# Altium schematic sheet INV.Main.SCH.SchDoc (part 2 of 2)
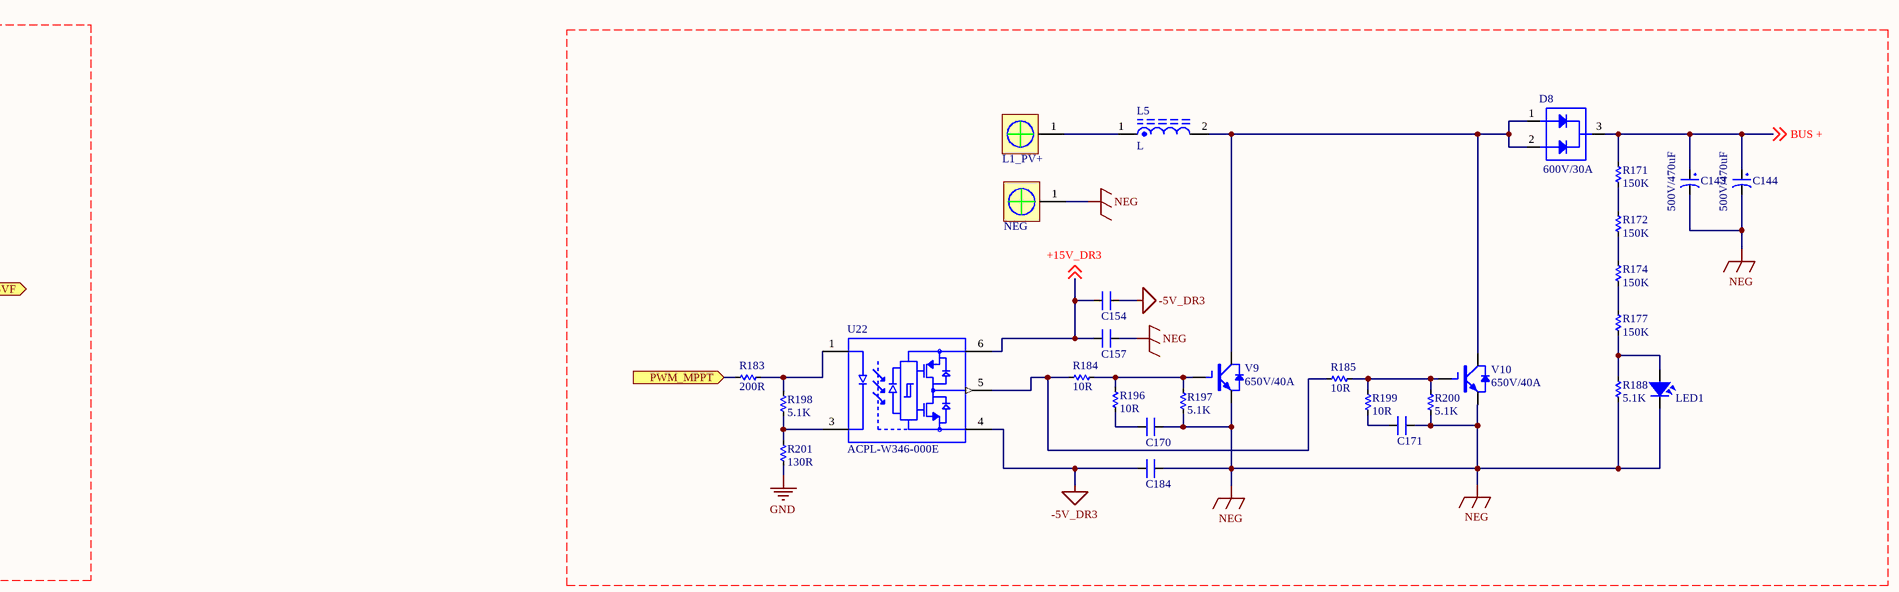
[diagram p8: INV.Main.SCH.SchDoc, bottom column 4 of 4]

## Library data of the parts
1 R167 R168 R173 R189 R205 R213 = Res-SMD: 1210; Manufacturer: Generic Components; Class: Passive; Published: 08/06/2000; Publisher: Altium Hobart Technology Centre
*1-*4 AC_L1 AC_N1 BAT+1 BAT-1 BUS_+1 L4 NEG1 = Copper
BT1 T3 = Tranfomer EE13: Designed by: VanDungEvn; Value: BAX
C1-C6 C9-C14 C17-C33 C35-C52 C54-C64 C70-C109 C112 C113 C131 C134 C139-C141 C154-C157 C164 C165 C170 C171 C184 = CAP-SMD: Value: 33pF
C7 = CAP C3D 35x46x35mm: capacitor E256238; MP: ECWFG2J475KA; MF: Panasonic; Value: *; Price: None; Package: MOLDED-2 Panasonic; Availability: In Stock; Check_prices: https://www.snapeda.com/parts/ECWFG2J475KA/Panasonic/view-part/?ref=eda; SnapEDA_Link: https://www.snapeda.com/parts/ECWFG2J475KA/Panasonic/view-part/?ref=snap
C8 C115 = Cap an toan: Metallized Polypropylene Film Capacitor; MP: ECWFG2J475KA; MF: Panasonic; Value: *; Price: None; Package: MOLDED-2 Panasonic; Availability: In Stock; Check_prices: https://www.snapeda.com/parts/ECWFG2J475KA/Panasonic/view-part/?ref=eda; SnapEDA_Link: https://www.snapeda.com/parts/ECWFG2J475KA/Panasonic/view-part/?ref=snap
C15 C16 C132 C133 C138 C142-C144 = Cap - 10x18 - N: Cắm; Don_Vi: Con; So_Chan: 2; Ten_Linh_Kien: Tụ Hóa 220uF 10V 6x11MM; Ma_Hang: MH004510; Chung_Loai: Cắm; Kieu_Chan: *
C34 C114 C203 = CAP N5-1n/500V: Metallized Polypropylene Film Capacitor; MP: ECWFG2J475KA; MF: Panasonic; Value: *; Price: None; Package: MOLDED-2 Panasonic; Availability: In Stock; Check_prices: https://www.snapeda.com/parts/ECWFG2J475KA/Panasonic/view-part/?ref=eda; SnapEDA_Link: https://www.snapeda.com/parts/ECWFG2J475KA/Panasonic/view-part/?ref=snap
C53 C110 C111 C116 C118-C125 C127-C130 C135-C137 C145 C147-C153 C158 C160-C163 C166-C168 C185 C187-C190 C192-C194 C197 C199-C202 C204-C207 C209-C215 = Tu dan gom: Tu khong phan cuc; Value: 0.47uF
C65-C68 = ECWFG2J475KA: Metallized Polypropylene Film Capacitor; MF: Panasonic; Value: *; Price: None; Package: MOLDED-2 Panasonic; MP: ECWFG2J475KA; Availability: In Stock; Check_prices: https://www.snapeda.com/parts/ECWFG2J475KA/Panasonic/view-part/?ref=eda; SnapEDA_Link: https://www.snapeda.com/parts/ECWFG2J475KA/Panasonic/view-part/?ref=snap
C69 = CAP X2 B32924: Metallized Polypropylene Film Capacitor; MP: ECWFG2J475KA; MF: Panasonic; Value: *; Price: None; Package: MOLDED-2 Panasonic; Availability: In Stock; Check_prices: https://www.snapeda.com/parts/ECWFG2J475KA/Panasonic/view-part/?ref=eda; SnapEDA_Link: https://www.snapeda.com/parts/ECWFG2J475KA/Panasonic/view-part/?ref=snap
C117 C126 C146 C159 C186 C198 C208 = Cap - 10x18 - N: Cắm 100uF 25V; Don_Vi: Con; So_Chan: 2; Ten_Linh_Kien: Tụ Hóa 220uF 10V 6x11MM; Ma_Hang: MH004510; Chung_Loai: Cắm; Kieu_Chan: *
C169 C191 C195 C196 = CC0603JRNPO9BN910: CAP CER 91PF 50V 5% COG/NPO 0603; Solder: SMT; CompanyID: VT-01341; Value: 91pF/50V; MPN: CC0603JRNPO9BN910; Category: CAPACITOR; PinCount: 2
C172-C183 = CC0603JRNPO9BN910: Cap Film; Solder: SMT; CompanyID: VT-01341; Value: 91pF/50V; MPN: CC0603JRNPO9BN910; Category: CAPACITOR; PinCount: 2
CE1 CE2 = CAP-ALU-DIP: 6x14mm; Published: 8-Jun-2000; LatestRevisionDate: 17-Jul-2002; LatestRevisionNote: Re-released for DXP Platform.; PackageReference: POLAR0.8; Publisher: Altium Limited
D1 D3-D7 D10-D13 D15-D17 = DIODE: Diode 600V 2A thay the ES2J; Value: 1N4007
D2 = Diode Double: 200V/5A TO-252 MURD520; MP: STTH2003CG-TR; Package: None; Price: None; Value: *; Availability: Unavailable
D8 = Diode Double: 600V/30A STTH30AC06 TO3P-3L; MP: STTH2003CG-TR; Package: None; Price: None; Value: *; Availability: Unavailable
D9 = Diode Double: MP: STTH2003CG-TR; Package: None; Price: None; Value: *; Availability: Unavailable
D14 = Diode Double: STTH2003 Series Dual 10 A 1 V 35 ns Secondary Rectifier Surface Mount - D2PAK; MP: STTH2003CG-TR; Package: None; Price: None; Value: *; Availability: Unavailable
FB1 FB2 = RC0603FR-0775RL: RES SMD 75 OHM 1% 1/10W 0603; Solder: SMT; Value: 75R; MPN: RC0603FR-0775RL; Category: RESISTOR; PinCount: 2
J1 NTC1 NTC2 = Jump2
J2 = Header 25x2: Header, 25x2-Pin 2.5mm; LatestRevisionDate: 17-Jul-2002; LatestRevisionNote: Re-released for DXP Platform.; Publisher: Altium Limited
J3 J4 = Header 15x2: Header, 15x2-Pin 2.5mm; LatestRevisionDate: 17-Jul-2002; LatestRevisionNote: Re-released for DXP Platform.; Publisher: Altium Limited
L1 = LBOSHOG-V1: Cuận cảm bộ sạc PWM Hybrid; Value: Loc 220; Designed by: VanDungEvn
L2 = LSINEOG-V1: Value: Loc 220; Designed by: VanDungEvn
L3 = Sensor current mini: Biến áp đo dòng; Value: Loc 220; Designed by: VanDungEvn
L5 = LBOSPVOG-V1: Cuận cảm bộ sạc PWM Hybrid; Value: Loc 220; Designed by: VanDungEvn
L6 = LBATOG-V1: Cuận cảm bộ sạc PWM Hybrid; Value: Loc 220; Designed by: VanDungEvn
LED1 = LED1-SMD: Value: LED 3 - 5 ly 2 Colour
P1 = Header 4P 2.54 Duc Thang: Cắm; Ten_Linh_Kien: Header 4P XH2.54-4P Đực Thẳng; Don_Vi: Con; Ma_Hang: MH001285; Chung_Loai: Cắm
Q1 Q4 Q11 Q12 = D882M: NPN 40V/2A PBSS4240T
Q2 Q3 Q9 Q10 = D882M: thay the D882
Q5 Q8 Q15 Q16 = B772M-PNP: PNP 40V/2A PBSS5240T; Value: C9015
Q6 Q7 Q13 Q14 = B772M-PNP: thay the B772; Value: C9015
QH1 = FGA25N120ANTD: IGBT NPT IKW50N65EH5 thay the xang IKW50N65ET7 - (QH4); MF: ON Semiconductor; Value: *; Digi-Key_Purchase_URL: https://www.digikey.in/product-detail/en/on-semiconductor/FGA25N120ANTDTU/FGA25N120ANTDTU-ND/820640?utm_source=snapeda&utm_medium=aggregator&utm_campaign=symbol; MP: FGA25N120ANTD; Package: TO-3 Fairchild Semiconductor; SnapEDA_Link: https://www.snapeda.com/parts/FGA25N120ANTD/ON%20Semiconductor/view-part/202622/?ref=snap; Digi-Key_Part_Number: FGA25N120ANTDTU-ND
QH2 = FGA25N120ANTD: IGBT NPT IKW50N65EH5 thay the xang IKW50N65ET7 - (QH1); MF: ON Semiconductor; Value: *; Digi-Key_Purchase_URL: https://www.digikey.in/product-detail/en/on-semiconductor/FGA25N120ANTDTU/FGA25N120ANTDTU-ND/820640?utm_source=snapeda&utm_medium=aggregator&utm_campaign=symbol; MP: FGA25N120ANTD; Package: TO-3 Fairchild Semiconductor; SnapEDA_Link: https://www.snapeda.com/parts/FGA25N120ANTD/ON%20Semiconductor/view-part/202622/?ref=snap; Digi-Key_Part_Number: FGA25N120ANTDTU-ND
QH3 = FGA25N120ANTD: IGBT NPT IKW50N65EH5 thay the xang IKW50N65ET7 - (QH7); MF: ON Semiconductor; Value: *; Digi-Key_Purchase_URL: https://www.digikey.in/product-detail/en/on-semiconductor/FGA25N120ANTDTU/FGA25N120ANTDTU-ND/820640?utm_source=snapeda&utm_medium=aggregator&utm_campaign=symbol; MP: FGA25N120ANTD; Package: TO-3 Fairchild Semiconductor; SnapEDA_Link: https://www.snapeda.com/parts/FGA25N120ANTD/ON%20Semiconductor/view-part/202622/?ref=snap; Digi-Key_Part_Number: FGA25N120ANTDTU-ND
QH4 = FGA25N120ANTD: IGBT NPT IKW50N65EH5 thay the xang IKW50N65ET7 - (QH8); MF: ON Semiconductor; Value: *; Digi-Key_Purchase_URL: https://www.digikey.in/product-detail/en/on-semiconductor/FGA25N120ANTDTU/FGA25N120ANTDTU-ND/820640?utm_source=snapeda&utm_medium=aggregator&utm_campaign=symbol; MP: FGA25N120ANTD; Package: TO-3 Fairchild Semiconductor; SnapEDA_Link: https://www.snapeda.com/parts/FGA25N120ANTD/ON%20Semiconductor/view-part/202622/?ref=snap; Digi-Key_Part_Number: FGA25N120ANTDTU-ND
QL1 = MOSFET IRF N: N-channel mosfet IRFP4468PBF - (QL2); Value: IRF840
QL2 = MOSFET IRF N: N-channel mosfet IRFP4468PBF - (QL3); Value: IRF840
QL3 = MOSFET IRF N: N-channel mosfet IRFP4468PBF - (QL5); Value: IRF840
QL4 = MOSFET IRF N: N-channel mosfet IRFP4468PBF (QL6); Value: IRF840
R1 R2 R11 R12 R21 R22 R27 R28 R33-R93 R99-R101 R107-R162 R169 R175 R176 R178-R187 R196-R203 = Res-SMD: 0805; Manufacturer: Generic Components; Class: Passive; Published: 08/06/2000; Publisher: Altium Hobart Technology Centre
R3-R10 R13-R20 R23-R26 R29-R32 R94-R97 R103-R106 R163-R166 = Res-SMD: 1206; Manufacturer: Generic Components; Class: Passive; Published: 08/06/2000; Publisher: Altium Hobart Technology Centre
R98 R102 R190-R195 R204 R206-R212 = R dan: Resistor 0805; Manufacturer: Generic Components; Class: Passive; Published: 08/06/2000; Publisher: Altium Hobart Technology Centre
R170-R172 R174 R177 R188 = Res-SMD: 1210 EX; Manufacturer: Generic Components; Class: Passive; Published: 08/06/2000; Publisher: Altium Hobart Technology Centre
T1 = Transfomer PM62: Biến áp xung 5KW PM62/44; MP: 14A-10R-10; Package: None; Price: None; Value: *; Availability: Unavailable
T2 = Transfomer EE28: MP: 14A-10R-10; Package: None; Price: None; Value: *; Availability: Unavailable
U1 U8 = Current sensor: Bien dong sinomags STB-CAS/R; Value: Loc 220; Designed by: VanDungEvn
U2-U7 U9-U18 U22 = ACPL-W346-000E: 2.5A Gate Driver Optical Coupling 5000Vrms 1 Channel 6-SO Stretched; MF: Broadcom Limited; Package: SOIC-6 Broadcom; Availability: Unavailable; MP: ACPL-W346-000E; Value: *; SnapEDA_Link: https://www.snapeda.com/parts/ACPL-W346-000E/Broadcom%20Limited/view-part/2767622/?ref=snap; Price: None
U19 = LM358 SOP8: Dán; Ma_Hang: MH000609; Don_Vi: Con; Ten_Linh_Kien: LM358 SOP8; Kieu_Chan: *; Ghi_Chu: *; Chung_Loai: Dán
U20 = LM358N/NOPB: MF: Texas Instruments; SnapEDA_Link: https://www.snapeda.com/parts/LM358N/NOPB/Texas+Instruments/view-part/?ref=snap; Package: PDIP-8 Texas; MP: LM358N/NOPB; Check_prices: https://www.snapeda.com/parts/LM358N/NOPB/Texas+Instruments/view-part/?ref=eda; Purchase-URL: https://pricing.snapeda.com/search/part/LM358N/NOPB/?ref=eda; Price: None; Value: *; Availability: In Stock
U21 = VOM617A-2T: OPTOISOLATOR 3.75KV TRANS 4-SOP; Solder: SMT; CompanyID: VT-xxxx; MPN: VOM617A-2T; Value: VOM617A-2T
V1 = FGA25N120ANTD: IGBT NPT G40H65DFB ST - (V11); MF: ON Semiconductor; Value: *; Digi-Key_Purchase_URL: https://www.digikey.in/product-detail/en/on-semiconductor/FGA25N120ANTDTU/FGA25N120ANTDTU-ND/820640?utm_source=snapeda&utm_medium=aggregator&utm_campaign=symbol; MP: FGA25N120ANTD; Package: TO-3 Fairchild Semiconductor; SnapEDA_Link: https://www.snapeda.com/parts/FGA25N120ANTD/ON%20Semiconductor/view-part/202622/?ref=snap; Digi-Key_Part_Number: FGA25N120ANTDTU-ND
V2 = FGA25N120ANTD: IGBT NPT STGWA80H65DFB (V3); MF: ON Semiconductor; Value: *; Digi-Key_Purchase_URL: https://www.digikey.in/product-detail/en/on-semiconductor/FGA25N120ANTDTU/FGA25N120ANTDTU-ND/820640?utm_source=snapeda&utm_medium=aggregator&utm_campaign=symbol; MP: FGA25N120ANTD; Package: TO-3 Fairchild Semiconductor; SnapEDA_Link: https://www.snapeda.com/parts/FGA25N120ANTD/ON%20Semiconductor/view-part/202622/?ref=snap; Digi-Key_Part_Number: FGA25N120ANTDTU-ND
V3 = FGA25N120ANTD: IGBT NPT STGWA80H65DFB (V2); MF: ON Semiconductor; Value: *; Digi-Key_Purchase_URL: https://www.digikey.in/product-detail/en/on-semiconductor/FGA25N120ANTDTU/FGA25N120ANTDTU-ND/820640?utm_source=snapeda&utm_medium=aggregator&utm_campaign=symbol; MP: FGA25N120ANTD; Package: TO-3 Fairchild Semiconductor; SnapEDA_Link: https://www.snapeda.com/parts/FGA25N120ANTD/ON%20Semiconductor/view-part/202622/?ref=snap; Digi-Key_Part_Number: FGA25N120ANTDTU-ND
V4 = FGA25N120ANTD: IGBT NPT G40H65DFB ST - (V12); MF: ON Semiconductor; Value: *; Digi-Key_Purchase_URL: https://www.digikey.in/product-detail/en/on-semiconductor/FGA25N120ANTDTU/FGA25N120ANTDTU-ND/820640?utm_source=snapeda&utm_medium=aggregator&utm_campaign=symbol; MP: FGA25N120ANTD; Package: TO-3 Fairchild Semiconductor; SnapEDA_Link: https://www.snapeda.com/parts/FGA25N120ANTD/ON%20Semiconductor/view-part/202622/?ref=snap; Digi-Key_Part_Number: FGA25N120ANTDTU-ND
V5 = FGA25N120ANTD: IGBT NPT STGWA80H65DFB - (V8); MF: ON Semiconductor; Value: *; Digi-Key_Purchase_URL: https://www.digikey.in/product-detail/en/on-semiconductor/FGA25N120ANTDTU/FGA25N120ANTDTU-ND/820640?utm_source=snapeda&utm_medium=aggregator&utm_campaign=symbol; MP: FGA25N120ANTD; Package: TO-3 Fairchild Semiconductor; SnapEDA_Link: https://www.snapeda.com/parts/FGA25N120ANTD/ON%20Semiconductor/view-part/202622/?ref=snap; Digi-Key_Part_Number: FGA25N120ANTDTU-ND
V6 = FGA25N120ANTD: IGBT NPT STGWA80H65DFB - (V5); MF: ON Semiconductor; Value: *; Digi-Key_Purchase_URL: https://www.digikey.in/product-detail/en/on-semiconductor/FGA25N120ANTDTU/FGA25N120ANTDTU-ND/820640?utm_source=snapeda&utm_medium=aggregator&utm_campaign=symbol; MP: FGA25N120ANTD; Package: TO-3 Fairchild Semiconductor; SnapEDA_Link: https://www.snapeda.com/parts/FGA25N120ANTD/ON%20Semiconductor/view-part/202622/?ref=snap; Digi-Key_Part_Number: FGA25N120ANTDTU-ND
V7 = FGA25N120ANTD: IGBT NPT STGWA80H65DFB (V7); MF: ON Semiconductor; Value: *; Digi-Key_Purchase_URL: https://www.digikey.in/product-detail/en/on-semiconductor/FGA25N120ANTDTU/FGA25N120ANTDTU-ND/820640?utm_source=snapeda&utm_medium=aggregator&utm_campaign=symbol; MP: FGA25N120ANTD; Package: TO-3 Fairchild Semiconductor; SnapEDA_Link: https://www.snapeda.com/parts/FGA25N120ANTD/ON%20Semiconductor/view-part/202622/?ref=snap; Digi-Key_Part_Number: FGA25N120ANTDTU-ND
V8 = FGA25N120ANTD: IGBT NPT STGWA80H65DFB (V6); MF: ON Semiconductor; Value: *; Digi-Key_Purchase_URL: https://www.digikey.in/product-detail/en/on-semiconductor/FGA25N120ANTDTU/FGA25N120ANTDTU-ND/820640?utm_source=snapeda&utm_medium=aggregator&utm_campaign=symbol; MP: FGA25N120ANTD; Package: TO-3 Fairchild Semiconductor; SnapEDA_Link: https://www.snapeda.com/parts/FGA25N120ANTD/ON%20Semiconductor/view-part/202622/?ref=snap; Digi-Key_Part_Number: FGA25N120ANTDTU-ND
V9 = FGA25N120ANTD: IGBT NPT G40H65DFB ST - (V4); MF: ON Semiconductor; Value: *; Digi-Key_Purchase_URL: https://www.digikey.in/product-detail/en/on-semiconductor/FGA25N120ANTDTU/FGA25N120ANTDTU-ND/820640?utm_source=snapeda&utm_medium=aggregator&utm_campaign=symbol; MP: FGA25N120ANTD; Package: TO-3 Fairchild Semiconductor; SnapEDA_Link: https://www.snapeda.com/parts/FGA25N120ANTD/ON%20Semiconductor/view-part/202622/?ref=snap; Digi-Key_Part_Number: FGA25N120ANTDTU-ND
V10 = FGA25N120ANTD: IGBT NPT G40H65DFB ST - (V1); MF: ON Semiconductor; Value: *; Digi-Key_Purchase_URL: https://www.digikey.in/product-detail/en/on-semiconductor/FGA25N120ANTDTU/FGA25N120ANTDTU-ND/820640?utm_source=snapeda&utm_medium=aggregator&utm_campaign=symbol; MP: FGA25N120ANTD; Package: TO-3 Fairchild Semiconductor; SnapEDA_Link: https://www.snapeda.com/parts/FGA25N120ANTD/ON%20Semiconductor/view-part/202622/?ref=snap; Digi-Key_Part_Number: FGA25N120ANTDTU-ND